# Altium project BACKPMAN3Rev1.0.PrjPcb (part 1 of 2)
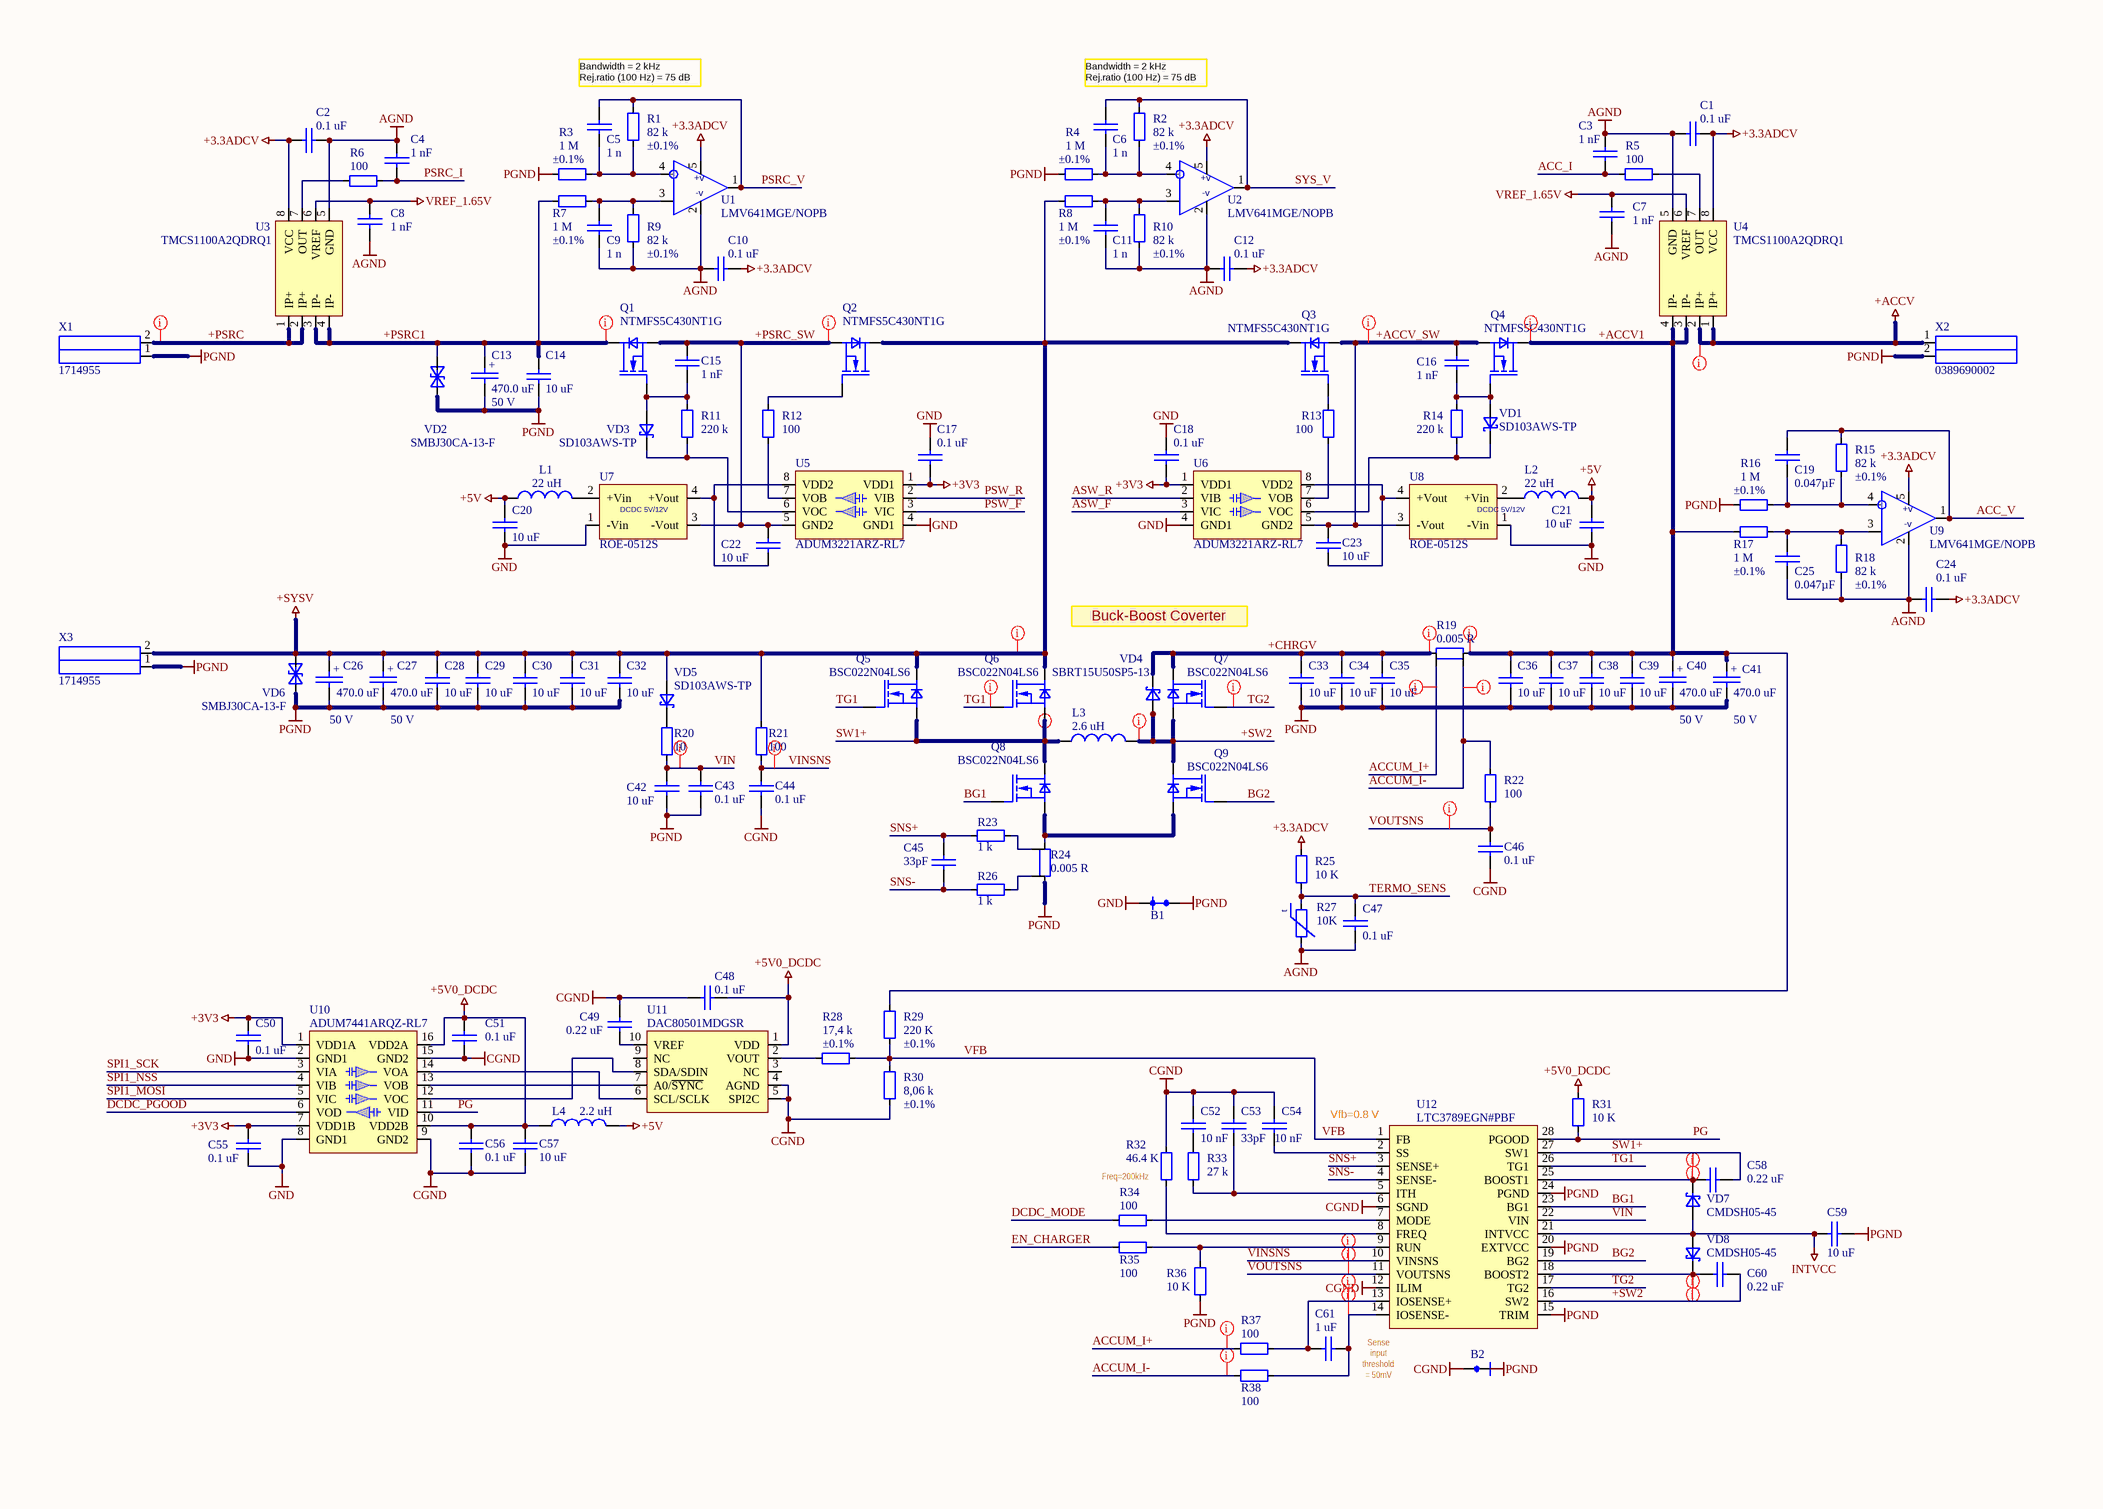
[diagram p0: BACKPMAN30_Charger.SchDoc]
4 sheets, 343 parts. Net scope: global (net labels, ports and power ports of the same name join across sheets).
Board file: BACKPMAN3Rev1.0.PcbDoc
Sheets:
  BACKPMAN30_Charger.SchDoc
  BACKPMAN30_CPU.SchDoc
  BACKPMAN30_Intfs.SchDoc
  BACKPMAN30_PwrSw.SchDoc

## Sheet BACKPMAN30_Charger.SchDoc
size A3

### Parts
B1  Net tie W10  [Net tee W 10 mm]  (value not drawn)  (net tie, no BOM)
B2  Net tie 0.3mm  [Net tee 0.3 mm]  (value not drawn)  (net tie, no BOM)
C1  value 0.1 uF  [1608[0603]]  (hidden comment: 0603B104K500CT)
C2  value 0.1 uF  [1608[0603]]  (hidden comment: 0603B104K500CT)
C3  value 1 nF  [0603 CAP]  (hidden comment: Capacitor)
C4  value 1 nF  [0603 CAP]  (hidden comment: Capacitor)
C5  value 1 n  [1608[0603]]  (hidden comment: 06033A102FAT2A)
C6  value 1 n  [1608[0603]]  (hidden comment: 06033A102FAT2A)
C7  value 1 nF  [0603 CAP]  (hidden comment: Capacitor)
C8  value 1 nF  [0603 CAP]  (hidden comment: Capacitor)
C9  value 1 n  [1608[0603]]  (hidden comment: 06033A102FAT2A)
C10  value 0.1 uF  [1608[0603]]  (hidden comment: 0603B104K500CT)
C11  value 1 n  [1608[0603]]  (hidden comment: 06033A102FAT2A)
C12  value 0.1 uF  [1608[0603]]  (hidden comment: 0603B104K500CT)
C13  value 470.0 uF  Voltage: 50 V  [Through Hole 12.5/20/5]  (hidden comment: EEU-FM1H471)
C14  value 10 uF  [3225[1210]]  (hidden comment: GMC32X7R106K50NT)
C15  value 1 nF  [0603 CAP]  (hidden comment: Capacitor)
C16  value 1 nF  [0603 CAP]  (hidden comment: Capacitor)
C17  value 0.1 uF  [1608[0603]]  (hidden comment: CL10B104KA8NNND)
C18  value 0.1 uF  [1608[0603]]  (hidden comment: CL10B104KA8NNND)
C19  value 0.047µF  [0603 CAP]  (hidden comment: Capacitor)
C20  value 10 uF  [3225[1210]]  (hidden comment: GMC32X7R106K50NT)
C21  value 10 uF  [3225[1210]]  (hidden comment: GMC32X7R106K50NT)
C22  value 10 uF  [3225[1210]]  (hidden comment: GMC32X7R106K50NT)
C23  value 10 uF  [3225[1210]]  (hidden comment: GMC32X7R106K50NT)
C24  value 0.1 uF  [1608[0603]]  (hidden comment: 0603B104K500CT)
C25  value 0.047µF  [0603 CAP]  (hidden comment: Capacitor)
C26  value 470.0 uF  Voltage: 50 V  [Through Hole 12.5/20/5]  (hidden comment: EEU-FM1H471)
C27  value 470.0 uF  Voltage: 50 V  [Through Hole 12.5/20/5]  (hidden comment: EEU-FM1H471)
C28  value 10 uF  [3225[1210]]  (hidden comment: GMC32X7R106K50NT)
C29  value 10 uF  [3225[1210]]  (hidden comment: GMC32X7R106K50NT)
C30  value 10 uF  [3225[1210]]  (hidden comment: GMC32X7R106K50NT)
C31  value 10 uF  [3225[1210]]  (hidden comment: GMC32X7R106K50NT)
C32  value 10 uF  [3225[1210]]  (hidden comment: GMC32X7R106K50NT)
C33  value 10 uF  [3225[1210]]  (hidden comment: GMC32X7R106K50NT)
C34  value 10 uF  [3225[1210]]  (hidden comment: GMC32X7R106K50NT)
C35  value 10 uF  [3225[1210]]  (hidden comment: GMC32X7R106K50NT)
C36  value 10 uF  [3225[1210]]  (hidden comment: GMC32X7R106K50NT)
C37  value 10 uF  [3225[1210]]  (hidden comment: GMC32X7R106K50NT)
C38  value 10 uF  [3225[1210]]  (hidden comment: GMC32X7R106K50NT)
C39  value 10 uF  [3225[1210]]  (hidden comment: GMC32X7R106K50NT)
C40  value 470.0 uF  Voltage: 50 V  [Through Hole 12.5/20/5]  (hidden comment: EEU-FM1H471)
C41  value 470.0 uF  Voltage: 50 V  [Through Hole 12.5/20/5]  (hidden comment: EEU-FM1H471)
C42  value 10 uF  [3225[1210]]  (hidden comment: GMC32X7R106K50NT)
C43  value 0.1 uF  [1608[0603]]  (hidden comment: 0603B104K500CT)
C44  value 0.1 uF  [1608[0603]]  (hidden comment: 0603B104K500CT)
C45  value 33pF  [0603 CAP]  (hidden comment: Capacitor)
C46  value 0.1 uF  [1608[0603]]  (hidden comment: 0603B104K500CT)
C47  value 0.1 uF  [1608[0603]]  (hidden comment: 0603B104K500CT)
C48  value 0.1 uF  [1608[0603]]  (hidden comment: 0603B104K500CT)
C49  value 0.22 uF  [1608[0603]]  (hidden comment: C1608X7R1H224K080AB)
C50  value 0.1 uF  [1608[0603]]  (hidden comment: CL10B104KA8NNND)
C51  value 0.1 uF  [1608[0603]]  (hidden comment: CL10B104KA8NNND)
C52  value 10 nF  [1608[0603]]  (hidden comment: GMC10X7R103M50NT)
C53  value 33pF  [0603 CAP]  (hidden comment: Capacitor)
C54  value 10 nF  [1608[0603]]  (hidden comment: GMC10X7R103M50NT)
C55  value 0.1 uF  [1608[0603]]  (hidden comment: CL10B104KA8NNND)
C56  value 0.1 uF  [1608[0603]]  (hidden comment: CL10B104KA8NNND)
C57  value 10 uF  [2012[0805]]  (hidden comment: GRM21BR61E106KA73L)
C58  value 0.22 uF  [1608[0603]]  (hidden comment: C1608X7R1H224K080AB)
C59  value 10 uF  [2012[0805]]  (hidden comment: GRM21BR61E106KA73L)
C60  value 0.22 uF  [1608[0603]]  (hidden comment: C1608X7R1H224K080AB)
C61  value 1 uF  [1608[0603]]  (hidden comment: C1608X5R1H105K080AB)
L1  value 22 uH  [2518]  (hidden comment: BRC2518T220K)
L2  value 22 uH  [2518]  (hidden comment: BRC2518T220K)
L3  value 2.6 uH  [7443556260   Wurth Elektronik]  (hidden comment: 7443556260)
L4  value 2.2 uH  [LSQPB3225]  (hidden comment: BRL3225T2R2M)
Q1  NTMFS5C430NT1G  [SO8FL Universal Footprint]
Q2  NTMFS5C430NT1G  [SO8FL Universal Footprint]
Q3  NTMFS5C430NT1G  [SO8FL Universal Footprint]
Q4  NTMFS5C430NT1G  [SO8FL Universal Footprint]
Q5  BSC022N04LS6  [SO8FL Universal Footprint]
Q6  BSC022N04LS6  [SO8FL Universal Footprint]
Q7  BSC022N04LS6  [SO8FL Universal Footprint]
Q8  BSC022N04LS6  [SO8FL Universal Footprint]
Q9  BSC022N04LS6  [SO8FL Universal Footprint]
R1  value 82 k  Tolerance: ±0.1%  [0603]  (hidden comment: Resistor)
R2  value 82 k  Tolerance: ±0.1%  [0603]  (hidden comment: Resistor)
R3  value 1 M  Tolerance: ±0.1%  [0805]  (hidden comment: RT0805BRE071ML)
R4  value 1 M  Tolerance: ±0.1%  [0805]  (hidden comment: RT0805BRE071ML)
R5  value 100  [0603]  (hidden comment: Resistor)
R6  value 100  [0603]  (hidden comment: Resistor)
R7  value 1 M  Tolerance: ±0.1%  [0805]  (hidden comment: RT0805BRE071ML)
R8  value 1 M  Tolerance: ±0.1%  [0805]  (hidden comment: RT0805BRE071ML)
R9  value 82 k  Tolerance: ±0.1%  [0603]  (hidden comment: Resistor)
R10  value 82 k  Tolerance: ±0.1%  [0603]  (hidden comment: Resistor)
R11  value 220 k  [0603]  (hidden comment: Resistor)
R12  value 100  [0603]  (hidden comment: Resistor)
R13  value 100  [0603]  (hidden comment: Resistor)
R14  value 220 k  [0603]  (hidden comment: Resistor)
R15  value 82 k  Tolerance: ±0.1%  [0603]  (hidden comment: Resistor)
R16  value 1 M  Tolerance: ±0.1%  [0805]  (hidden comment: RT0805BRE071ML)
R17  value 1 M  Tolerance: ±0.1%  [0805]  (hidden comment: RT0805BRE071ML)
R18  value 82 k  Tolerance: ±0.1%  [0603]  (hidden comment: Resistor)
R19  value 0.005 R  [FC4L110]  (hidden comment: FC4L110R005FER)
R20  value 10  [0805]  (hidden comment: Resistor)
R21  value 100  [0603]  (hidden comment: Resistor)
R22  value 100  [0603]  (hidden comment: Resistor)
R23  value 1 k  [0603]  (hidden comment: Resistor)
R24  value 0.005 R  [FC4L110]  (hidden comment: FC4L110R005FER)
R25  value 10 K  [0603]  (hidden comment: RMCF0603FT10K0)
R26  value 1 k  [0603]  (hidden comment: Resistor)
R27  value 10K  [0603]  (hidden comment: NTCG163JX103DTDS)
R28  value 17,4 k  Tolerance: ±0.1%  [0603]  (hidden comment: Resistor)
R29  value 220 K  Tolerance: ±0.1%  [0603]  (hidden comment: TNPW0603220KBEEA)
R30  value 8,06 k  Tolerance: ±0.1%  [0603]  (hidden comment: Resistor)
R31  value 10 K  [0603]  (hidden comment: RMCF0603FT10K0)
R32  value 46.4 K  [0603]  (hidden comment: RC0603FR-0746K4L)
R33  value 27 k  [0603]  (hidden comment: Resistor)
R34  value 100  [0603]  (hidden comment: Resistor)
R35  value 100  [0603]  (hidden comment: Resistor)
R36  value 10 K  [0603]  (hidden comment: RMCF0603FT10K0)
R37  value 100  [0603]  (hidden comment: Resistor)
R38  value 100  [0603]  (hidden comment: Resistor)
U1  LMV641MGE/NOPB  [SOT-353 ON Semi]
U2  LMV641MGE/NOPB  [SOT-353 ON Semi]
U3  TMCS1100A2QDRQ1  [8-SOIC Linear]
U4  TMCS1100A2QDRQ1  [8-SOIC Linear]
U5  ADUM3221ARZ-RL7  [8-SOIC Linear]
U6  ADUM3221ARZ-RL7  [8-SOIC Linear]
U7  ROE-0512S  [Recom 4-SIP module]
U8  ROE-0512S  [Recom 4-SIP module]
U9  LMV641MGE/NOPB  [SOT-353 ON Semi]
U10  ADUM7441ARQZ-RL7  [QSOP-16 AD]
U11  DAC80501MDGSR  [10-Lead Plastic MSOP Linear]
U12  LTC3789EGN#PBF  [28-Lead Plastic SSOP Linear]
VD1  SD103AWS-TP  [SOD323]
VD2  SMBJ30CA-13-F  [DO-214AA_SMBJ BI]
VD3  SD103AWS-TP  [SOD323]
VD4  SBRT15U50SP5-13  [PowerDI 5]
VD5  SD103AWS-TP  [SOD323]
VD6  SMBJ30CA-13-F  [DO-214AA_SMBJ BI]
VD7  PartName: CMDSH05-45  [SOD323]  (hidden comment: CMDSH05-45 TR PBFREE)
VD8  PartName: CMDSH05-45  [SOD323]  (hidden comment: CMDSH05-45 TR PBFREE)
X1  1714955  [MKDS5/2-6.35]
X2  0389690002  [Molex 389690002]
X3  1714955  [MKDS5/2-6.35]

### Nets
+3.3ADCV: C1.2 C2.2 C10.1 C12.1 C24.1 R25.2 U1.5(V+) U2.5(V+) U3.8(VCC) U4.8(VCC) U9.5(V+)
+3V3: C17.1 C18.1 C50.2 C55.2 U5.1(VDD1) U6.1(VDD1) U10.1(VDD1A) U10.7(VDD1B)
+5V: C20.1 C21.1 L1.1 L2.1 L4.2
+5V0_DCDC: C48.1 C51.2 C56.2 C57.2 L4.1 R31.1 U10.10(VDD2B) U10.16(VDD2A) U11.1(VDD)
+ACCV: U4.1(IP+) U4.2(IP+) X2.1
+SYSV: C26.1 C27.1 C28.1 C29.1 C30.1 C31.1 C32.1 Q2.3(D) Q3.3(D) Q5.3(D) Q6.3(D) R8.1 R21.2 VD5.1(A) VD6.2(A) X3.2
AGND: C1.1 C2.1 C3.2 C4.2 C7.1 C8.1 C9.2 C10.2 C11.2 C12.2 C24.2 C25.2 C47.2 R9.1 R10.1 R18.1 R27.1 U1.2(GND) U2.2(GND) U3.5(GND) U4.5(GND) U9.2(GND)
CGND: B2.2 C44.2 C46.2 C48.2 C49.1 C51.1 C52.1 C53.1 C54.1 C56.1 C57.1 R30.1 R32.1 U10.9(GND2) U10.15(GND2) U11.4(AGND) U11.5(SPI2C) U12.6(SGND) U12.12(ILIM)
GND: B1.1 C17.2 C18.2 C20.2 C21.2 C50.1 C55.1 U5.4(GND1) U6.4(GND1) U7.1(-Vin) U8.1(-Vin) U10.2(GND1) U10.8(GND1)
INTVCC: C59.1 U12.21(INTVCC) VD7.1(A) VD8.1(A)
PGND: B1.2 B2.1 C13.2 C14.2 C26.2 C27.2 C28.2 C29.2 C30.2 C31.2 C32.2 C33.2 C34.2 C35.2 C36.2 C37.2 C38.2 C39.2 C40.2 C41.2 C42.2 C43.2 C59.2 R3.1 R4.1 R16.1 R24.2 R36.1 U12.15(TRIM) U12.20(EXTVCC) U12.24(PGND) VD2.1(C) VD6.1(C) X1.1 X2.2 X3.1
VREF_1.65V: C7.2 C8.2 U3.6(VREF) U4.6(VREF)
+ACCV1: C36.1 C37.1 C38.1 C39.1 C40.1 C41.1 Q4.3(D) R17.1 R19.2 R29.2 U4.3(IP-) U4.4(IP-)
+ACCV_SW: C16.2 C23.1 Q3.2(S) Q4.2(S) U6.5(GND2) U8.3(-Vout)
+CHRGV: C33.1 C34.1 C35.1 Q7.3(D) R19.1 VD4.3
+PSRC: U3.1(IP+) U3.2(IP+) X1.2
+PSRC1: C13.1 C14.1 Q1.3(D) R7.1 U3.3(IP-) U3.4(IP-) VD2.2(A)
+PSRC_SW: C15.2 C22.1 Q1.2(S) Q2.2(S) U5.5(GND2) U7.3(-Vout)
+SW2: C60.2 L3.2 Q7.2(S) Q9.3(D) U12.16(SW2) VD4.1 VD4.2
ACC_I: C3.1 R5.1
ACC_V: C19.1 R15.2 U9.1(OUT)
ACCUM_I+: R19.3 R37.2
ACCUM_I-: R19.4 R22.2 R38.2
ASW_F: U6.3(VIC)
ASW_R: U6.2(VIB)
BG1: Q8.1(G) U12.23(BG1)
BG2: Q9.1(G) U12.19(BG2)
DCDC_MODE: R34.2
DCDC_PGOOD: U10.6(VOD)
EN_CHARGER: R35.2
PG: R31.2 U10.11(VID) U12.28(PGOOD)
PSRC_I: C4.1 R6.1
PSRC_V: C5.1 R1.2 U1.1(OUT)
PSW_F: U5.3(VIC)
PSW_R: U5.2(VIB)
SNS+: C45.1 R23.2 U12.3(SENSE+)
SNS-: C45.2 R26.2 U12.4(SENSE-)
SPI1_MOSI: U10.5(VIC)
SPI1_NSS: U10.4(VIB)
SPI1_SCK: U10.3(VIA)
SW1+: C58.2 L3.1 Q5.2(S) Q6.2(S) Q8.3(D) U12.27(SW1)
SYS_V: C6.1 R2.2 U2.1(OUT)
TERMO_SENS: C47.1 R25.1 R27.2
TG1: Q5.1(G) Q6.1(G) U12.26(TG1)
TG2: Q7.1(G) U12.17(TG2)
VFB: R28.2 R29.1 R30.2 U12.1(FB)
VIN: C42.1 C43.1 R20.1 U12.22(VIN)
VINSNS: C44.1 R21.1 U12.10(VINSNS)
VOUTSNS: C46.1 R22.1 U12.11(VOUTSNS)
NetC5_2: C5.2 R1.1 R3.2 U1.4(IN-)
NetC6_2: C6.2 R2.1 R4.2 U2.4(IN-)
NetC9_1: C9.1 R7.2 R9.2 U1.3(IN+)
NetC11_1: C11.1 R8.2 R10.2 U2.3(IN+)
NetC15_1: C15.1 Q1.1(G) R11.2 VD3.1(A)
NetC16_1: C16.1 Q4.1(G) R14.2 VD1.1(A)
NetC19_2: C19.2 R15.1 R16.2 U9.4(IN-)
NetC22_2: C22.2 U5.8(VDD2) U7.4(+Vout)
NetC23_2: C23.2 U6.8(VDD2) U8.4(+Vout)
NetC25_1: C25.1 R17.2 R18.2 U9.3(IN+)
NetC49_2: C49.2 U11.10(VREF)
NetC52_2: C52.2 R33.2
NetC53_2: C53.2 R33.1 U12.5(ITH)
NetC54_2: C54.2 U12.2(SS)
NetC58_1: C58.1 U12.25(BOOST1) VD7.2(C)
NetC60_1: C60.1 U12.18(BOOST2) VD8.2(C)
NetC61_1: C61.1 R38.1 U12.14(IOSENSE-)
NetC61_2: C61.2 R37.1 U12.13(IOSENSE+)
NetL1_2: L1.2 U7.2(+Vin)
NetL2_2: L2.2 U8.2(+Vin)
NetQ2_1: Q2.1(G) R12.2
NetQ3_1: Q3.1(G) R13.2
NetQ8_2: Q8.2(S) Q9.2(S) R24.1
NetR5_2: R5.2 U4.7(OUT)
NetR6_2: R6.2 U3.7(OUT)
NetR11_1: R11.1 U5.6(VOC) VD3.2(C)
NetR12_1: R12.1 U5.7(VOB)
NetR13_1: R13.1 U6.7(VOB)
NetR14_1: R14.1 U6.6(VOC) VD1.2(C)
NetR20_2: R20.2 VD5.2(C)
NetR23_1: R23.1 R24.3
NetR24_4: R24.4 R26.1
NetR28_1: R28.1 U11.2(VOUT)
NetR32_2: R32.2 U12.8(FREQ)
NetR34_1: R34.1 U12.7(MODE)
NetR35_1: R35.1 R36.2 U12.9(RUN)
NetU10_12: U10.12(VOC) U11.8(SDA/SDIN)
NetU10_13: U10.13(VOB) U11.7(A0/~{SYNC})
NetU10_14: U10.14(VOA) U11.6(SCL/SCLK)

Not connected (* = marked no-connect by the designer): U11 3(NC) 9(NC)

### Layout directives
net class 24V: +ACCV, +ACCV1, +ACCV_SW, +CHRGV, +PSRC, +PSRC1, +PSRC_SW, +SW2, +SYSV, ACCUM_I+, ACCUM_I-, NetC58_1, NetC60_1, NetC61_1, NetC61_2, SW1+, TG1, TG2, VIN, VINSNS, VOUTSNS

### Notes on the sheet
- Bandwidth = 2 kHz
  Rej.ratio (100 Hz) = 75 dB
- Buck-Boost Coverter
- (near U12) Vfb=0.8 V
- (near R32) Freq=200kHz
- Sense input threshold = 50mV
- (in symbol EEU-FM1H471) +
- (in symbol LMV641MGE/NOPB) +v; -v
- (in symbol NTCG163JX103DTDS) t
- (in symbol ROE-0512S) DCDC 5V/12V

### Library data of the parts
B1 = Net tie W10: Net tie width 10 mm
C1 C2 C10 C12 C17 C18 C24 C43 C44 C46-C48 C50 C51 C55 C56 = 0603B104K500CT: 0.1 µF ±10% 50V Ceramic Capacitor X7R 0603 (1608 Metric), -55°C ~ 125°C; Manufacturer: Walsin Technology Corporation; PartNum: 1292-1643-1-ND; Tolerance: +-10%; Distributor: Digi-Key; PartName: 0603B104K500CT; Price: 0.0062 Euro; Voltage: 50V
C3 C4 C7 C8 C15 C16 = CC0603JRX7R9BB102: 1000pF, ±5%, 50V, X7R, 0603 (1608 Metric), -55°C ~ 125°C, -, General Purpose; Manufacturer: Yageo; PartNum: 311-3361-1-ND; Voltage - Rated: 50V; Part Number: CC0603JRX7R9BB102; Distributor: Digi-Key; PartName: CC0603JRX7R9BB102; Price: 0.01920; Tolerance: ±5%; Temperature Coefficient: X7R; Operating Temperature: -55°C ~ 125°C; Features: -; Package / Case: 0603 (1608 Metric)
C5 C6 C9 C11 = 06033A102FAT2A: 1000 pF ±1% 25V Ceramic Capacitor C0G, NP0 0603 (1608 Metric), -55°C ~ 125°C; Manufacturer: AVX Corporation; PartNum: 478-7896-1-ND; Tolerance: ±1%; Price: 0.2$; Distributor: DigiKey; Voltage: 25 V; PartName: 06033A102FAT2A
C13 C26 C27 C40 C41 = EEU-FM1H471: 470.0uF, 50V, Aluminium Electrolytic Capacitors, Diam. 12.5mm, Lead sp. 5 mm, Length 22mm, 2.26 mA, 22 mOhms, 5000 Hour, -40°C...105°C; Manufacturer: Panasonic Electronic Components; PartNum: P12400-ND; Tolerance: +-20%; Distributor: Digi-Key; Price: 0.52$; PartName: EEU-FM1H471
C14 C20-C23 C28-C39 C42 = GMC32X7R106K50NT: 10 µF ±10%, 50V, Ceramic Capacitor X7R, 1210 (3225 Metric), -55°C ~ 125°C; Manufacturer: CAL-CHIP ELECTRONICS, INC.; PartNum: 2571-GMC32X7R106K50NTTR-ND; Distributor: Digi-Key; PartName: GMC32X7R106K50NT; Tolerance: ±10%; Voltage: 50V
C19 C25 = CC0603JRX7R9BB473: 0.047µF, ±5%, 50V, X7R, 0603 (1608 Metric), -55°C ~ 125°C, -, General Purpose; Manufacturer: Yageo; PartNum: 311-4019-1-ND; Part Number: CC0603JRX7R9BB473; Distributor: Digi-Key; PartName: CC0603JRX7R9BB473; Price: 0.03660; Tolerance: ±5%; Voltage - Rated: 50V; Temperature Coefficient: X7R; Operating Temperature: -55°C ~ 125°C; Features: -; Package / Case: 0603 (1608 Metric)
C45 C53 = 885012006054: 33pF, ±5%, 50V, C0G, NP0, 0603 (1608 Metric), -55°C ~ 125°C, -, General Purpose; Manufacturer: Wurth Electronics Inc.; PartNum: 732-7796-1-ND; Voltage - Rated: 50V; Part Number: 885012006054; Distributor: Digi-Key; PartName: 885012006054; Price: 0.02150; Tolerance: ±5%; Temperature Coefficient: C0G, NP0; Operating Temperature: -55°C ~ 125°C; Features: -; Package / Case: 0603 (1608 Metric)
C49 C58 C60 = C1608X7R1H224K080AB: 0.22 uF, ±10% 50V Ceramic Capacitor X7R, Low ESL 0603 (1608 Metric), -55°C ~ 125°C; Manufacturer: TDK Corporation; PartNum: 445-7408-1-ND; Tolerance: +-10%; Distributor: Digi-Key; PartName: C1608X7R1H224K080AB; Price: 0.0062 Euro; Voltage: 50 V
C52 C54 = GMC10X7R103M50NT: 10 nF, ±20%, 50V,  Ceramic Capacitor X7R 0603 (1608 Metric), -55°C ~ 125°C; Manufacturer: CAL-CHIP ELECTRONICS, INC.; PartNum: 2571-GMC10X7R103M50NTTR-ND; Tolerance: +-10%; Distributor: Digi-Key; PartName: GMC10X7R103M50NT; Price: 0.0047 Euro; Voltage: 50 V
C57 C59 = GRM21BR61E106KA73L: 10 µF ±10%, 25V, Ceramic Capacitor X5R 0805 (2012 Metric),  -55°C ~ 85°C; Manufacturer: Murata Electronics; PartNum: 490-5523-1-ND; Distributor: Digi-Key; PartName: GRM21BR61E106KA73L; Price: 0.11$; Tolerance: ±10%; Voltage: 25V
C61 = C1608X5R1H105K080AB: 1 uF, ±10%, Low ESL, 50V, Ceramic Capacitor X5R 0603 (1608 Metric), -55°C ~ 85°C; Manufacturer: Venkel; PartNum: 445-7468-1-ND; Distributor: Digi-Key; PartName: C1608X5R1H105K080AB; Tolerance: ±10%; Voltage: 50V
L1 L2 = BRC2518T220K: 22 µH Unshielded Wirewound Inductor, 490 mA, 560mOhm, 1007 (2518 Metric); Manufacturer: Taiyo Yuden; PartNum: 587-2439-1-ND; Tolerance: ±10%; Distributor: Digi-Key; PartName: BRC2518T220K; Supplier 1: Digi-Key; Supplier Part Number 1: 587-2439-1-ND
L3 = 7443556260: 2.6 uH, 31.5 A, ±20%, 1.58 mOhm, -40°C ~ 125°C; Manufacturer: Würth Elektronik; PartNum: 732-2170-1-ND; Distributor: Digi-Key; Price: 5.35$; Tolerance: ±20%; PartName: 7443556260
L4 = BRL3225T2R2M: Inductors 2.2 uH, 1.6 A, 0.078 Ohms, ±20% -40°C ~ 105°C, 1210 (3225 Metric); Manufacturer: Taiyo Yuden; PartNum: 587-2165-1-ND; Distributor: Digi-Key; Price: 0.16$; Tolerance: ±20%; PartName: BRL3225T2R2M
Q1-Q4 = NTMFS5C430NT1G: MOSFET N-CH, 35A (Ta), 185A (Tc), 40V, Vgs=±20V, 1.7 mOhm, 47nC @ 10V, 5-DFN (5x6), -55°C ~ 175°C; Manufacturer: Texas Instruments; PartNum: NTMFS5C430NT1GOSCT-ND; Price: 2.68$; Distributor: Digi-Key; PartName: NTMFS5C430NT1G
Q5-Q9 = BSC022N04LS6ATMA1: MOSFET N-CH, 100 A, 60V, Vgs=±20V, 1.8 mOhm, 41nC @ 10V, 5-DFN (5x6), -55°C ~ 150°C; Manufacturer: Infineon Technologies; PartNum: BSC022N04LS6ATMA1CT-ND; Price: 1.33; Distributor: Digi-Key; PartName: BSC022N04LS6ATMA1; Supplier 1: Digi-Key; Supplier Part Number 1: BSC022N04LS6ATMA1CT-ND
R1 R2 R9 R10 R15 R18 = ERA-3AEB823V: 82 kOhms, ±0.1%, 0.1W, 1/10W, Thin Film, ±25ppm/°C, 0603 (1608 Metric), -55°C ~ 155°C, Automotive AEC-Q200; Manufacturer: Panasonic Electronic Components; PartNum: P82KDBCT-ND; Voltage: 75V; Distributor: Digi-Key; Price: 0.26; PartName: ERA-3AEB823V; Part Number: ERA-3AEB823V; Temperature Coefficient: ±25ppm/°C; Operating Temperature: -55°C ~ 155°C; Power (Watts): 0.1W, 1/10W; Features: Automotive AEC-Q200; Package / Case: 0603 (1608 Metric)
R3 R4 R7 R8 R16 R17 = RT0805BRE071ML: 1M, ±0.1%, ±50ppm/°C, 0.125W, 1/8W Chip Resistor 0805 (2012 Metric) - Thin Film,-55°C ~ 155°C; Manufacturer: YAGEO; PartNum: YAG4967CT-ND; Distributor: Digi-Key; Price: 0.09$; PartName: RT0805BRE071ML
R5 R6 R12 R13 R21 R22 R34 R35 R37 R38 = RMCF0603FT100R: 100 Ohms, ±1%, 0.1W, 1/10W, Thick Film, ±100ppm/°C, 0603 (1608 Metric), -55°C ~ 155°C, Automotive AEC-Q200; Manufacturer: Stackpole Electronics Inc.; PartNum: RMCF0603FT100RCT-ND; Voltage: 75V; Distributor: Digi-Key; Price: 0.00690; Tolerance: ±1%; PartName: RMCF0603FT100R; Part Number: RMCF0603FT100R; Temperature Coefficient: ±100ppm/°C; Operating Temperature: -55°C ~ 155°C; Power (Watts): 0.1W, 1/10W; Features: Automotive AEC-Q200; Package / Case: 0603 (1608 Metric)
R11 R14 = RMCF0603FT220K: 220 kOhms, ±1%, 0.1W, 1/10W, Thick Film, ±100ppm/°C, 0603 (1608 Metric), -55°C ~ 155°C, Automotive AEC-Q200; Manufacturer: Stackpole Electronics Inc.; PartNum: RMCF0603FT220KCT-ND; Voltage: 75V; Distributor: Digi-Key; Price: 0.00690; Tolerance: ±1%; PartName: RMCF0603FT220K; Part Number: RMCF0603FT220K; Temperature Coefficient: ±100ppm/°C; Operating Temperature: -55°C ~ 155°C; Power (Watts): 0.1W, 1/10W; Features: Automotive AEC-Q200; Package / Case: 0603 (1608 Metric)
R19 R24 = FC4L110R005FER: Curr.sens.res. 0.005 OHM 5W 1% , 4320 (50110 Metric); Manufacturer: Ohmite; PartNum: 588-FC4L110R005FER; Distributor: Digi-Key; Price: 2.42; Tolerance: 1%; PartName: FC4L110R005FER
R20 = RMCF0805FT10R0: 10 Ohms, ±1%, 0.125W, 1/8W, Thick Film, ±100ppm/°C, 0805 (2012 Metric), -55°C ~ 155°C, Automotive AEC-Q200; Manufacturer: Stackpole Electronics Inc.; PartNum: RMCF0805FT10R0CT-ND; Voltage: 150V; Distributor: Digi-Key; Price: 0.00950; Tolerance: ±1%; PartName: RMCF0805FT10R0; Part Number: RMCF0805FT10R0; Temperature Coefficient: ±100ppm/°C; Operating Temperature: -55°C ~ 155°C; Power (Watts): 0.125W, 1/8W; Features: Automotive AEC-Q200; Package / Case: 0805 (2012 Metric)
R23 R26 = RMCF0603FG1K00: 1 kOhms, ±1%, 0.1W, 1/10W, Thick Film, ±100ppm/°C, 0603 (1608 Metric), -55°C ~ 155°C, Automotive AEC-Q200; Manufacturer: Stackpole Electronics Inc.; PartNum: RMCF0603FG1K00CT-ND; Voltage: 75V; Distributor: Digi-Key; Price: 0.00690; Tolerance: ±1%; PartName: RMCF0603FG1K00; Part Number: RMCF0603FG1K00; Temperature Coefficient: ±100ppm/°C; Operating Temperature: -55°C ~ 155°C; Power (Watts): 0.1W, 1/10W; Features: Automotive AEC-Q200; Package / Case: 0603 (1608 Metric)
R25 R31 R36 = RMCF0603FT10K0: 10 kOhms ±1%, ±100ppm/°C,  0.1W, 1/10W Chip Resistor 0603 (1608 Metric) Automotive AEC-Q200 Thick Film, -55°C ~ 155°C; Manufacturer: Stackpole Electronics Inc; PartNum: RMCF0603FT10K0CT-ND; Distributor: Digi-Key; Price: 0.0017$; Tolerance: 1%; PartName: RMCF0603FT10K0
R27 = NTCG163JX103DTDS: NTC Thermistor 10k, B25/50 3380K, ±0.5%,  0603 (1608 Metric), -40°C ~ 125°C; Manufacturer: TDK Corporation; PartNum: 445-174519-1-ND; Distributor: Digi-Key; Price: 0.22; PartName: NTCG163JX103DTDS
R28 = ERA-3AEB1742V: 17,4 kOhms, ±0.1%, 0.1W, 1/10W, Thin Film, ±25ppm/°C, 0603 (1608 Metric), -55°C ~ 155°C, Automotive AEC-Q200; Manufacturer: Panasonic Electronic Components; PartNum: P17.4KDBCT-ND; Voltage: 75V; Distributor: Digi-Key; Price: 0.26; PartName: ERA-3AEB1742V; Part Number: ERA-3AEB1742V; Temperature Coefficient: ±25ppm/°C; Operating Temperature: -55°C ~ 155°C; Power (Watts): 0.1W, 1/10W; Features: Automotive AEC-Q200; Package / Case: 0603 (1608 Metric)
R29 = TNPW0603220KBEEA: 220 kOhms ±0.1% 0.125W, 1/8W Chip Resistor 0603 (1608 Metric), Thin Film; Manufacturer: Vishay Dale; PartNum: 541-3175-1-ND; Distributor: Digi-Key; Price: 0.11$; PartName: TNPW0603220KBEEA
R30 = ERA-3AEB8061V: 8,06 kOhms, ±0.1%, 0.1W, 1/10W, Thin Film, ±25ppm/°C, 0603 (1608 Metric), -55°C ~ 155°C, Automotive AEC-Q200; Manufacturer: Panasonic Electronic Components; PartNum: P8.06KDBCT-ND; Voltage: 75V; Distributor: Digi-Key; Price: 0.26; PartName: ERA-3AEB8061V; Part Number: ERA-3AEB8061V; Temperature Coefficient: ±25ppm/°C; Operating Temperature: -55°C ~ 155°C; Power (Watts): 0.1W, 1/10W; Features: Automotive AEC-Q200; Package / Case: 0603 (1608 Metric)
R32 = RC0603FR-0746K4L: 46.4 kOhms ±1% 0.1W, 1/10W Chip Resistor 0603 (1608 Metric) Moisture Resistant Thick Film; Manufacturer: YAGEO; PartNum: 311-46.4KHRCT-ND; Voltage: 75 V; Distributor: Digi-Key; Price: 0.008 Euro; Tolerance: 1%; PartName: RC0603FR-0746K4L
R33 = RMCF0603FT27K0: 27 kOhms, ±1%, 0.1W, 1/10W, Thick Film, ±100ppm/°C, 0603 (1608 Metric), -55°C ~ 155°C, Automotive AEC-Q200; Manufacturer: Stackpole Electronics Inc.; PartNum: RMCF0603FT27K0CT-ND; Voltage: 75V; Distributor: Digi-Key; Price: 0.00690; Tolerance: ±1%; PartName: RMCF0603FT27K0; Part Number: RMCF0603FT27K0; Temperature Coefficient: ±100ppm/°C; Operating Temperature: -55°C ~ 155°C; Power (Watts): 0.1W, 1/10W; Features: Automotive AEC-Q200; Package / Case: 0603 (1608 Metric)
U1 U2 U9 = LMV641MGE/NOPB: OpAmp,  Rail-to-Rail,  10MHz, VSS 2.7V ~ 12V, Vofs 30µV,  SC-70-5, -40°C ~ 125°C; Manufacturer: Texas Instruments; PartNum: LMV641MGE/NOPBCT-ND; Price: 1.8$; Distributor: Digi-Key; PartName: LMV641MGE/NOPB; Supplier 1: Digi-Key; Supplier Part Number 1: 296-OPA991IDBVRCT-ND
U3 U4 = TMCS1100A2QDRQ1: Current Sensor ±14.5A, VCC=3V,  Hall Effect Bidirectional 8-SOIC (0.154", 3.90mm Width), -40°C ~ 125°C (TA); Manufacturer: Texas Instruments; PartNum: 595-TMCS1100A2QDRQ1; Price: 2.5$; Distributor: Mouser; PartName: TMCS1100A2QDRQ1
U5 U6 = ADUM3221ARZ-RL7: 4A Gate Driver Magnetic Coupling 2500Vrms 2 Channel 8-SOIC, -40°C ~ 125°C; Manufacturer: Analog Devices Inc.; PartNum: ADUM3221ARZ-RL7CT-ND; Distributor: Digi-Key; Price: 3.1$; PartName: ADUM3221ARZ-RL7
U7 U8 = ROE-0512S: Isolated Module DC DC Converter 1 Output 12V - - 84mA 4.5V - 5.5V Input; Manufacturer: Recom Power; PartNum: ROE-0512S-ND; Price: 2.8$; Distributor: Digi-Key; PartName: ROE-0512S; Supplier 1: Digi-Key; Supplier Part Number 1: ROE-0512S-ND
U10 = ADUM7441ARQZ-RL7: General Purpose Digital Isolator 1000Vrms 4 Channel 1Mbps 15kV/µs CMTI 16-SSOP (0.154", 3.90mm Width), -40°C ~ 105°C; Manufacturer: Analog Devices Inc.; PartNum: ADUM7441ARQZ-RL7CT-ND; Distributor: Digi-Key; Price: 2.4$; PartName: ADUM7441ARQZ-RL7
U11 = DAC80501MDGSR: 16 Bit Digital to Analog Converter, I²C, SPI, 10-VSSOP,  -40°C ~ 125°C; Manufacturer: Texas Instruments; PartNum: 296-DAC80501MDGSRCT-ND; Distributor: Digi-Key; PartName: DAC80501MDGSR; Price: 6$; Supplier 1: Digi-Key; Supplier Part Number 1: 296-DAC80501MDGSTCT-ND
U12 = LTC3789EGN#PBF: Buck-Boost Regulator Positive Output Step-Up/Step-Down DC-DC Controller IC, Vin 4...38V,  28-SSOP, -40°C ~ 125°C; Manufacturer: Linear Technology/Analog Devices; PartNum: LTC3789EGN#PBF-ND; Distributor: Digi-Key; PartName: LTC3789EGN#PBF; price: 5.6$; Supplier 1: Digi-Key; Supplier Part Number 1: LTC3789EGN#PBF-ND
VD1 VD3 VD5 = SD103AWS-TP: Diode Schottky 40 V 350mA Surface Mount SOD-323, -65°C ~ 125°C; Manufacturer: Micro Commercial Co; PartNum: SD103AWSTPMSCT-ND; PartName: SD103AWS-TP; Distributor: Digi-Key; Price: 0.1$
VD2 VD6 = SMBJ30CA-13-F: TVS 600W, Vbr=33.3V, Vcl=48.4V,  Bidirectional, SMB, -55°C ~ 150°C; Manufacturer: Diodes Incorporated; PartNum: SMBJ30CA-FDICT-ND; Voltage: 30V; Distributor: Digi-Key; Price: 0.21$; PartName: SMBJ30CA-13-F; Supplier 1: Digi-Key; Supplier Part Number 1: SMBJ30CA-FDICT-ND
VD4 = SBRT15U50SP5-13: Schottky Power Rectifier 15A, 50V, 470mV @ 15A, SMA, -65°C ~ 150°C; Manufacturer: Diodes Incorporated; PartNum: SBRT15U50SP5-13DICT-ND; Price: 0.83$; Distributor: Digi-Key; PartName: SBRT15U50SP5-13
VD7 VD8 = CMDSH05-45 TR PBFREE: Diode Schottky 45 V 500mA Surface Mount SOD-323, -65°C ~ 125°C; Manufacturer: Central Semiconductor Corp; PartNum: 1514-CMDSH05-45TRPBFREECT-ND; Distributor: Digi-Key; Price: 0.23$
X1 X3 = 1714955: TERMINAL BLOCK, 2WAY, 6.35 mm, 32A, 500V; Manufacturer: Phoenix Contact; PartNum: 277-1269-ND; Distributor: Digi-Key; Price: 1.49 Euro; PartName: 1714955
X2 = 0389690002: 2 Circuit 0.500" (12.70mm) Barrier Block Connector Screws with Captive Plate, 50A, 600V, 8-20AWG; Manufacturer: Molex; PartNum: WM7469-ND; Distributor: Digi-Key; Price: 1.03$; PartName: 0389690002

## Sheet BACKPMAN30_CPU.SchDoc
size A3
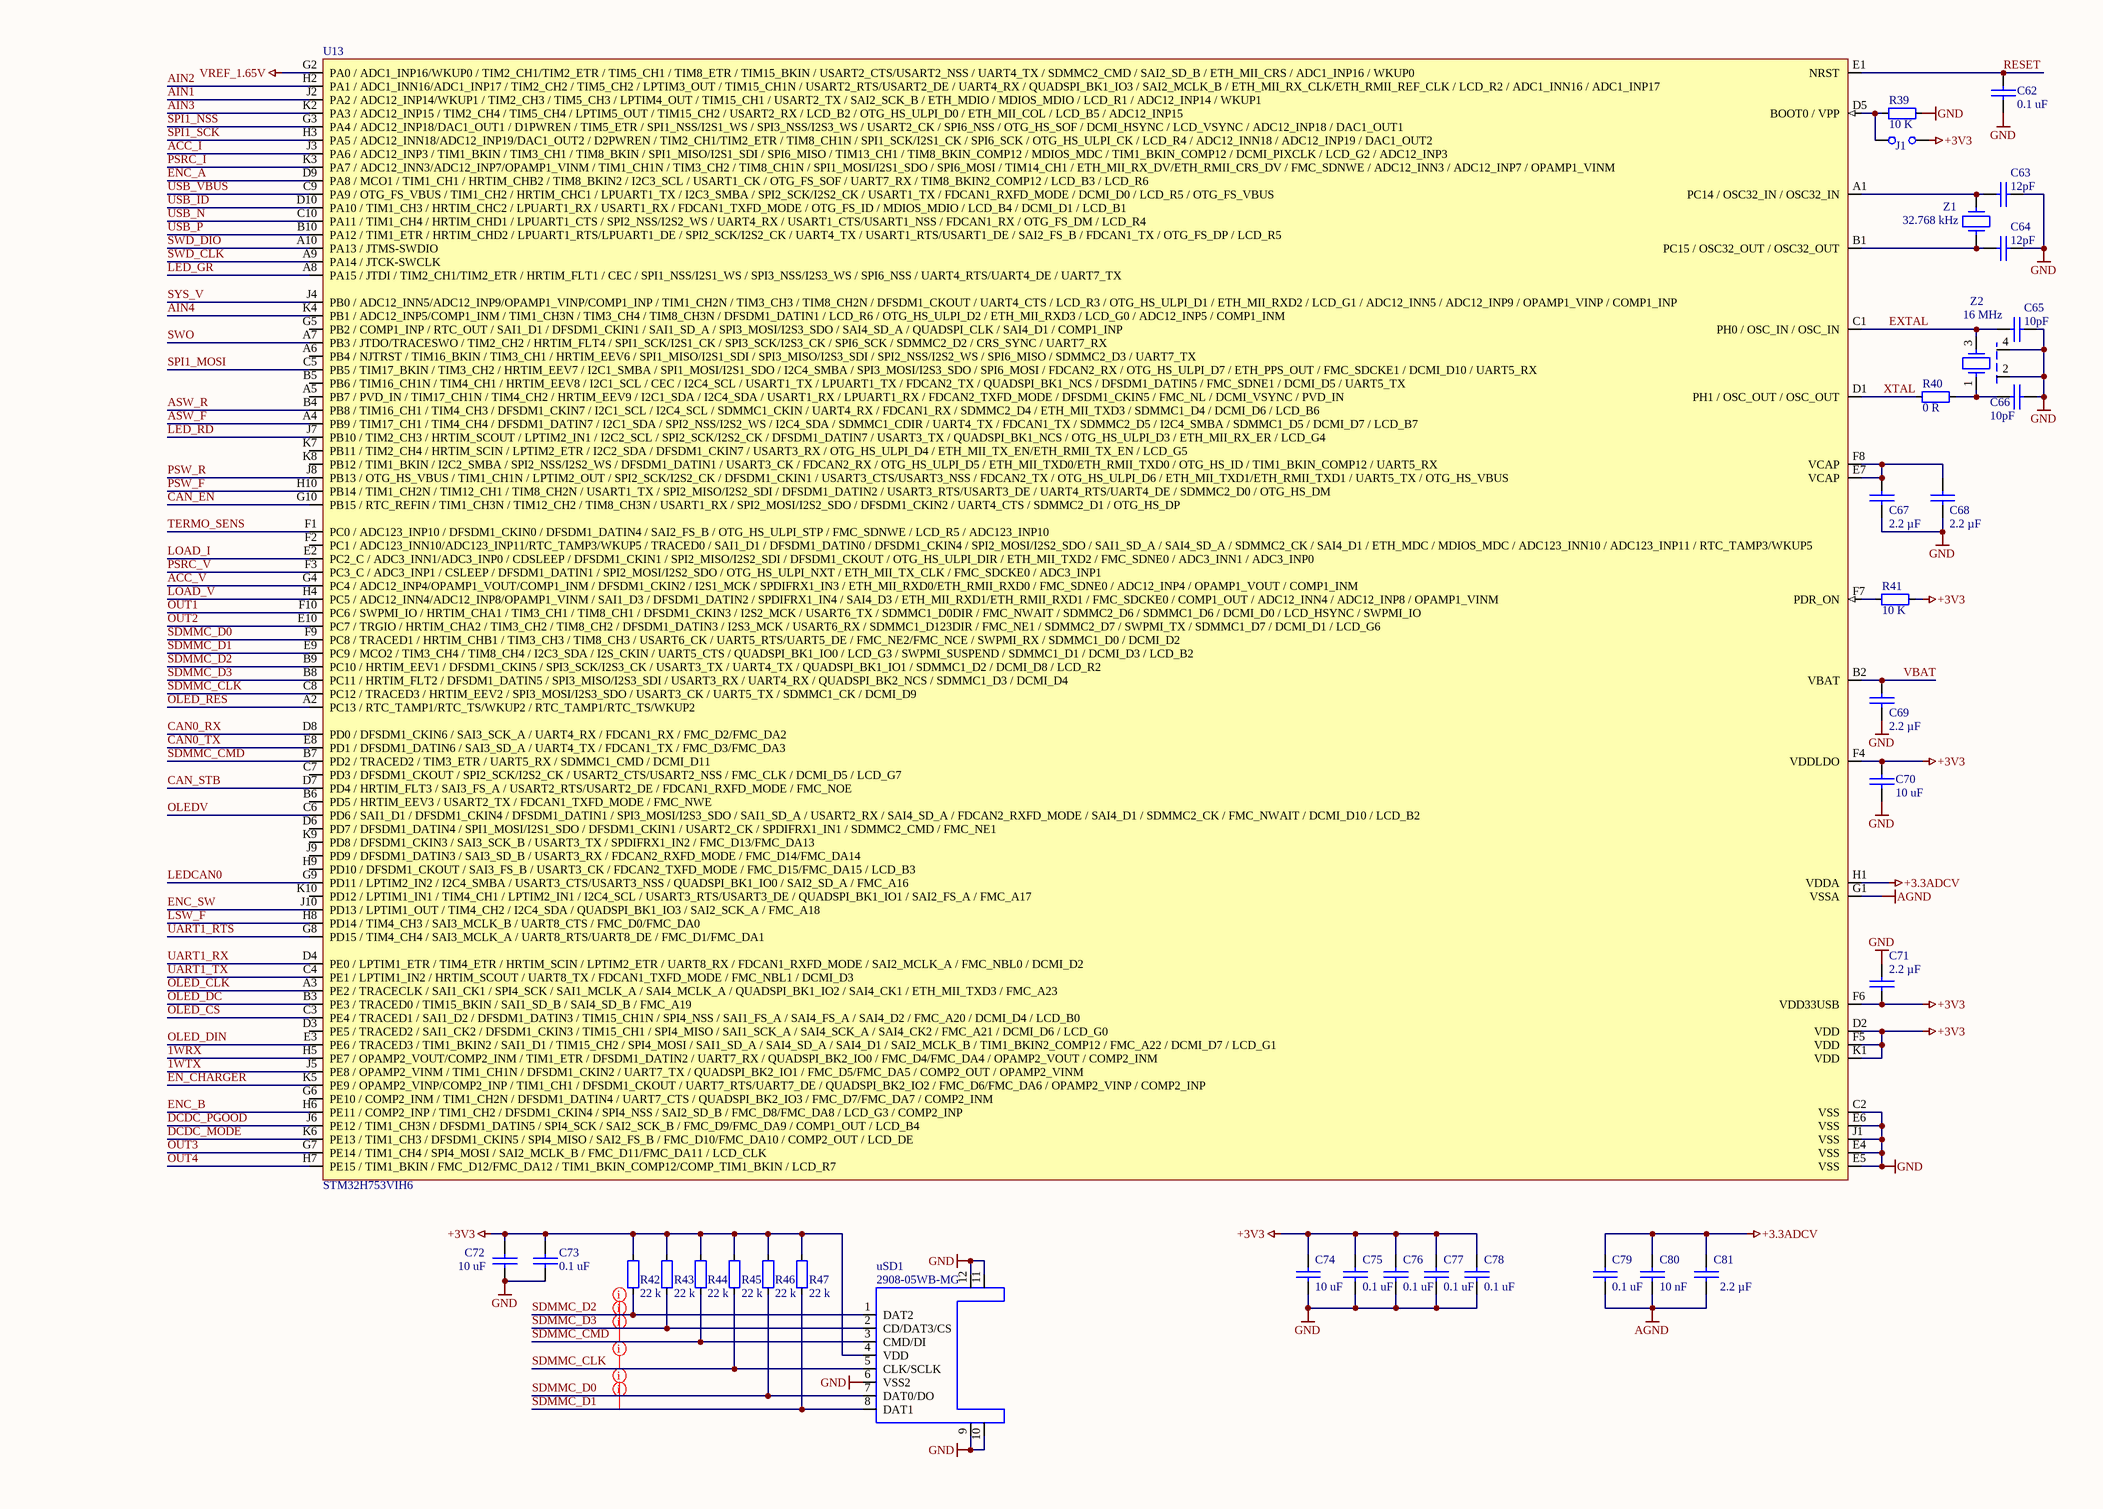
[diagram p1: BACKPMAN30_CPU.SchDoc]

### Parts
C62  value 0.1 uF  [1608[0603]]  (hidden comment: CL10B104KA8NNND)
C63  value 12pF  [0402 CAP]  (hidden comment: Capacitor)
C64  value 12pF  [0402 CAP]  (hidden comment: Capacitor)
C65  value 10pF  [0402 CAP]  (hidden comment: Capacitor)
C66  value 10pF  [0402 CAP]  (hidden comment: Capacitor)
C67  value 2.2 µF  [1608[0603]]  (hidden comment: C1608X5R1C225K080AB)
C68  value 2.2 µF  [1608[0603]]  (hidden comment: C1608X5R1C225K080AB)
C69  value 2.2 µF  [1608[0603]]  (hidden comment: C1608X5R1C225K080AB)
C70  value 10 uF  [2012[0805]]  (hidden comment: GRM21BR61E106KA73L)
C71  value 2.2 µF  [1608[0603]]  (hidden comment: C1608X5R1C225K080AB)
C72  value 10 uF  [2012[0805]]  (hidden comment: GRM21BR61E106KA73L)
C73  value 0.1 uF  [1608[0603]]  (hidden comment: 0603B104K500CT)
C74  value 10 uF  [2012[0805]]  (hidden comment: GRM21BR61E106KA73L)
C75  value 0.1 uF  [1608[0603]]  (hidden comment: CL10B104KA8NNND)
C76  value 0.1 uF  [1608[0603]]  (hidden comment: CL10B104KA8NNND)
C77  value 0.1 uF  [1608[0603]]  (hidden comment: CL10B104KA8NNND)
C78  value 0.1 uF  [1608[0603]]  (hidden comment: CL10B104KA8NNND)
C79  value 0.1 uF  [1608[0603]]  (hidden comment: CL10B104KA8NNND)
C80  value 10 nF  [1608[0603]]  (hidden comment: GMC10X7R103M50NT)
C81  value 2.2 µF  [1608[0603]]  (hidden comment: C1608X5R1C225K080AB)
J1  PH1-02-TA-HT  [HDR1X2V]  (value not drawn)
R39  value 10 K  [0603]  (hidden comment: RMCF0603FT10K0)
R40  value 0 R  [0603]  (hidden comment: CR0603-10W-000T)
R41  value 10 K  [0603]  (hidden comment: RMCF0603FT10K0)
R42  value 22 k  [0402]  (hidden comment: Resistor)
R43  value 22 k  [0402]  (hidden comment: Resistor)
R44  value 22 k  [0402]  (hidden comment: Resistor)
R45  value 22 k  [0402]  (hidden comment: Resistor)
R46  value 22 k  [0402]  (hidden comment: Resistor)
R47  value 22 k  [0402]  (hidden comment: Resistor)
U13  STM32H753VIH6  [TFBGA100]
uSD1  2908-05WB-MG  [2908-05WB-MG]
Z1  value 32.768 kHz  [ABS7]  (hidden comment: ABS07-32.768KHZ-T)
Z2  value 16 MHz  [4-SMD 2.00mm x 1.60mm]  (hidden comment: ABM11-16.000MHZ-9-B1U-T)

### Nets
+3.3ADCV: C79.2 C80.1 C81.1 U13.H1(VDDA)
+3V3: C70.2 C71.2 C72.2 C73.2 C74.2 C75.2 C76.2 C77.2 C78.2 J1.2 R41.1 R42.2 R43.2 R44.2 R45.2 R46.2 R47.2 U13.D2(VDD) U13.F4(VDDLDO) U13.F5(VDD) U13.F6(VDD33USB) U13.K1(VDD) uSD1.4(VDD)
AGND: C79.1 C80.2 C81.2 U13.G1(VSSA)
GND: C62.2 C63.2 C64.2 C65.2 C66.2 C67.2 C68.2 C69.2 C70.1 C71.1 C72.1 C73.1 C74.1 C75.1 C76.1 C77.1 C78.1 R39.1 U13.C2(VSS) U13.E4(VSS) U13.E5(VSS) U13.E6(VSS) U13.J1(VSS) uSD1.6(VSS2) uSD1.9 uSD1.10(WP) uSD1.11(GND) uSD1.12(GND) Z2.2 Z2.4
VREF_1.65V: U13.G2(PA0_/_ADC1_INP16/WKUP0_/_TIM2_CH1/TIM2_ETR_/_TIM5_CH1_/_TIM8_ETR_/_TIM15_BKIN_/_USART2_CTS/USART2_NSS_/_UART4_TX_/_SDMMC2_CMD_/_SAI2_SD_B_/_ETH_MII_CRS_/_ADC1_INP16_/_WKUP0)
1WRX: U13.H5(PE7_/_OPAMP2_VOUT/COMP2_INM_/_TIM1_ETR_/_DFSDM1_DATIN2_/_UART7_RX_/_QUADSPI_BK2_IO0_/_FMC_D4/FMC_DA4_/_OPAMP2_VOUT_/_COMP2_INM)
1WTX: U13.J5(PE8_/_OPAMP2_VINM_/_TIM1_CH1N_/_DFSDM1_CKIN2_/_UART7_TX_/_QUADSPI_BK2_IO1_/_FMC_D5/FMC_DA5_/_COMP2_OUT_/_OPAMP2_VINM)
ACC_I: U13.J3(PA6_/_ADC12_INP3_/_TIM1_BKIN_/_TIM3_CH1_/_TIM8_BKIN_/_SPI1_MISO/I2S1_SDI_/_SPI6_MISO_/_TIM13_CH1_/_TIM8_BKIN_COMP12_/_MDIOS_MDC_/_TIM1_BKIN_COMP12_/_DCMI_PIXCLK_/_LCD_G2_/_ADC12_INP3)
ACC_V: U13.G4(PC4_/_ADC12_INP4/OPAMP1_VOUT/COMP1_INM_/_DFSDM1_CKIN2_/_I2S1_MCK_/_SPDIFRX1_IN3_/_ETH_MII_RXD0/ETH_RMII_RXD0_/_FMC_SDNE0_/_ADC12_INP4_/_OPAMP1_VOUT_/_COMP1_INM)
AIN1: U13.J2(PA2_/_ADC12_INP14/WKUP1_/_TIM2_CH3_/_TIM5_CH3_/_LPTIM4_OUT_/_TIM15_CH1_/_USART2_TX_/_SAI2_SCK_B_/_ETH_MDIO_/_MDIOS_MDIO_/_LCD_R1_/_ADC12_INP14_/_WKUP1)
AIN2: U13.H2(PA1_/_ADC1_INN16/ADC1_INP17_/_TIM2_CH2_/_TIM5_CH2_/_LPTIM3_OUT_/_TIM15_CH1N_/_USART2_RTS/USART2_DE_/_UART4_RX_/_QUADSPI_BK1_IO3_/_SAI2_MCLK_B_/_ETH_MII_RX_CLK/ETH_RMII_REF_CLK_/_LCD_R2_/_ADC1_INN16_/_ADC1_INP17)
AIN3: U13.K2(PA3_/_ADC12_INP15_/_TIM2_CH4_/_TIM5_CH4_/_LPTIM5_OUT_/_TIM15_CH2_/_USART2_RX_/_LCD_B2_/_OTG_HS_ULPI_D0_/_ETH_MII_COL_/_LCD_B5_/_ADC12_INP15)
AIN4: U13.K4(PB1_/_ADC12_INP5/COMP1_INM_/_TIM1_CH3N_/_TIM3_CH4_/_TIM8_CH3N_/_DFSDM1_DATIN1_/_LCD_R6_/_OTG_HS_ULPI_D2_/_ETH_MII_RXD3_/_LCD_G0_/_ADC12_INP5_/_COMP1_INM)
ASW_F: U13.A4(PB9_/_TIM17_CH1_/_TIM4_CH4_/_DFSDM1_DATIN7_/_I2C1_SDA_/_SPI2_NSS/I2S2_WS_/_I2C4_SDA_/_SDMMC1_CDIR_/_UART4_TX_/_FDCAN1_TX_/_SDMMC2_D5_/_I2C4_SMBA_/_SDMMC1_D5_/_DCMI_D7_/_LCD_B7)
ASW_R: U13.B4(PB8_/_TIM16_CH1_/_TIM4_CH3_/_DFSDM1_CKIN7_/_I2C1_SCL_/_I2C4_SCL_/_SDMMC1_CKIN_/_UART4_RX_/_FDCAN1_RX_/_SDMMC2_D4_/_ETH_MII_TXD3_/_SDMMC1_D4_/_DCMI_D6_/_LCD_B6)
CAN0_RX: U13.D8(PD0_/_DFSDM1_CKIN6_/_SAI3_SCK_A_/_UART4_RX_/_FDCAN1_RX_/_FMC_D2/FMC_DA2)
CAN0_TX: U13.E8(PD1_/_DFSDM1_DATIN6_/_SAI3_SD_A_/_UART4_TX_/_FDCAN1_TX_/_FMC_D3/FMC_DA3)
CAN_EN: U13.G10(PB15_/_RTC_REFIN_/_TIM1_CH3N_/_TIM12_CH2_/_TIM8_CH3N_/_USART1_RX_/_SPI2_MOSI/I2S2_SDO_/_DFSDM1_CKIN2_/_UART4_CTS_/_SDMMC2_D1_/_OTG_HS_DP)
CAN_STB: U13.D7(PD4_/_HRTIM_FLT3_/_SAI3_FS_A_/_USART2_RTS/USART2_DE_/_FDCAN1_RXFD_MODE_/_FMC_NOE)
DCDC_MODE: U13.K6(PE13_/_TIM1_CH3_/_DFSDM1_CKIN5_/_SPI4_MISO_/_SAI2_FS_B_/_FMC_D10/FMC_DA10_/_COMP2_OUT_/_LCD_DE)
DCDC_PGOOD: U13.J6(PE12_/_TIM1_CH3N_/_DFSDM1_DATIN5_/_SPI4_SCK_/_SAI2_SCK_B_/_FMC_D9/FMC_DA9_/_COMP1_OUT_/_LCD_B4)
EN_CHARGER: U13.K5(PE9_/_OPAMP2_VINP/COMP2_INP_/_TIM1_CH1_/_DFSDM1_CKOUT_/_UART7_RTS/UART7_DE_/_QUADSPI_BK2_IO2_/_FMC_D6/FMC_DA6_/_OPAMP2_VINP_/_COMP2_INP)
ENC_A: U13.D9(PA8_/_MCO1_/_TIM1_CH1_/_HRTIM_CHB2_/_TIM8_BKIN2_/_I2C3_SCL_/_USART1_CK_/_OTG_FS_SOF_/_UART7_RX_/_TIM8_BKIN2_COMP12_/_LCD_B3_/_LCD_R6)
ENC_B: U13.H6(PE11_/_COMP2_INP_/_TIM1_CH2_/_DFSDM1_CKIN4_/_SPI4_NSS_/_SAI2_SD_B_/_FMC_D8/FMC_DA8_/_LCD_G3_/_COMP2_INP)
ENC_SW: U13.J10(PD13_/_LPTIM1_OUT_/_TIM4_CH2_/_I2C4_SDA_/_QUADSPI_BK1_IO3_/_SAI2_SCK_A_/_FMC_A18)
EXTAL: C65.1 U13.C1(PH0_/_OSC_IN_/_OSC_IN) Z2.3
LED_GR: U13.A8(PA15_/_JTDI_/_TIM2_CH1/TIM2_ETR_/_HRTIM_FLT1_/_CEC_/_SPI1_NSS/I2S1_WS_/_SPI3_NSS/I2S3_WS_/_SPI6_NSS_/_UART4_RTS/UART4_DE_/_UART7_TX)
LED_RD: U13.J7(PB10_/_TIM2_CH3_/_HRTIM_SCOUT_/_LPTIM2_IN1_/_I2C2_SCL_/_SPI2_SCK/I2S2_CK_/_DFSDM1_DATIN7_/_USART3_TX_/_QUADSPI_BK1_NCS_/_OTG_HS_ULPI_D3_/_ETH_MII_RX_ER_/_LCD_G4)
LEDCAN0: U13.G9(PD11_/_LPTIM2_IN2_/_I2C4_SMBA_/_USART3_CTS/USART3_NSS_/_QUADSPI_BK1_IO0_/_SAI2_SD_A_/_FMC_A16)
LOAD_I: U13.E2(PC2_C_/_ADC3_INN1/ADC3_INP0_/_CDSLEEP_/_DFSDM1_CKIN1_/_SPI2_MISO/I2S2_SDI_/_DFSDM1_CKOUT_/_OTG_HS_ULPI_DIR_/_ETH_MII_TXD2_/_FMC_SDNE0_/_ADC3_INN1_/_ADC3_INP0)
LOAD_V: U13.H4(PC5_/_ADC12_INN4/ADC12_INP8/OPAMP1_VINM_/_SAI1_D3_/_DFSDM1_DATIN2_/_SPDIFRX1_IN4_/_SAI4_D3_/_ETH_MII_RXD1/ETH_RMII_RXD1_/_FMC_SDCKE0_/_COMP1_OUT_/_ADC12_INN4_/_ADC12_INP8_/_OPAMP1_VINM)
LSW_F: U13.H8(PD14_/_TIM4_CH3_/_SAI3_MCLK_B_/_UART8_CTS_/_FMC_D0/FMC_DA0)
OLED_CLK: U13.A3(PE2_/_TRACECLK_/_SAI1_CK1_/_SPI4_SCK_/_SAI1_MCLK_A_/_SAI4_MCLK_A_/_QUADSPI_BK1_IO2_/_SAI4_CK1_/_ETH_MII_TXD3_/_FMC_A23)
OLED_CS: U13.C3(PE4_/_TRACED1_/_SAI1_D2_/_DFSDM1_DATIN3_/_TIM15_CH1N_/_SPI4_NSS_/_SAI1_FS_A_/_SAI4_FS_A_/_SAI4_D2_/_FMC_A20_/_DCMI_D4_/_LCD_B0)
OLED_DC: U13.B3(PE3_/_TRACED0_/_TIM15_BKIN_/_SAI1_SD_B_/_SAI4_SD_B_/_FMC_A19)
OLED_DIN: U13.E3(PE6_/_TRACED3_/_TIM1_BKIN2_/_SAI1_D1_/_TIM15_CH2_/_SPI4_MOSI_/_SAI1_SD_A_/_SAI4_SD_A_/_SAI4_D1_/_SAI2_MCLK_B_/_TIM1_BKIN2_COMP12_/_FMC_A22_/_DCMI_D7_/_LCD_G1)
OLED_RES: U13.A2(PC13_/_RTC_TAMP1/RTC_TS/WKUP2_/_RTC_TAMP1/RTC_TS/WKUP2)
OLEDV: U13.C6(PD6_/_SAI1_D1_/_DFSDM1_CKIN4_/_DFSDM1_DATIN1_/_SPI3_MOSI/I2S3_SDO_/_SAI1_SD_A_/_USART2_RX_/_SAI4_SD_A_/_FDCAN2_RXFD_MODE_/_SAI4_D1_/_SDMMC2_CK_/_FMC_NWAIT_/_DCMI_D10_/_LCD_B2)
OUT1: U13.F10(PC6_/_SWPMI_IO_/_HRTIM_CHA1_/_TIM3_CH1_/_TIM8_CH1_/_DFSDM1_CKIN3_/_I2S2_MCK_/_USART6_TX_/_SDMMC1_D0DIR_/_FMC_NWAIT_/_SDMMC2_D6_/_SDMMC1_D6_/_DCMI_D0_/_LCD_HSYNC_/_SWPMI_IO)
OUT2: U13.E10(PC7_/_TRGIO_/_HRTIM_CHA2_/_TIM3_CH2_/_TIM8_CH2_/_DFSDM1_DATIN3_/_I2S3_MCK_/_USART6_RX_/_SDMMC1_D123DIR_/_FMC_NE1_/_SDMMC2_D7_/_SWPMI_TX_/_SDMMC1_D7_/_DCMI_D1_/_LCD_G6)
OUT3: U13.G7(PE14_/_TIM1_CH4_/_SPI4_MOSI_/_SAI2_MCLK_B_/_FMC_D11/FMC_DA11_/_LCD_CLK)
OUT4: U13.H7(PE15_/_TIM1_BKIN_/_FMC_D12/FMC_DA12_/_TIM1_BKIN_COMP12/COMP_TIM1_BKIN_/_LCD_R7)
PSRC_I: U13.K3(PA7_/_ADC12_INN3/ADC12_INP7/OPAMP1_VINM_/_TIM1_CH1N_/_TIM3_CH2_/_TIM8_CH1N_/_SPI1_MOSI/I2S1_SDO_/_SPI6_MOSI_/_TIM14_CH1_/_ETH_MII_RX_DV/ETH_RMII_CRS_DV_/_FMC_SDNWE_/_ADC12_INN3_/_ADC12_INP7_/_OPAMP1_VINM)
PSRC_V: U13.F3(PC3_C_/_ADC3_INP1_/_CSLEEP_/_DFSDM1_DATIN1_/_SPI2_MOSI/I2S2_SDO_/_OTG_HS_ULPI_NXT_/_ETH_MII_TX_CLK_/_FMC_SDCKE0_/_ADC3_INP1)
PSW_F: U13.H10(PB14_/_TIM1_CH2N_/_TIM12_CH1_/_TIM8_CH2N_/_USART1_TX_/_SPI2_MISO/I2S2_SDI_/_DFSDM1_DATIN2_/_USART3_RTS/USART3_DE_/_UART4_RTS/UART4_DE_/_SDMMC2_D0_/_OTG_HS_DM)
PSW_R: U13.J8(PB13_/_OTG_HS_VBUS_/_TIM1_CH1N_/_LPTIM2_OUT_/_SPI2_SCK/I2S2_CK_/_DFSDM1_CKIN1_/_USART3_CTS/USART3_NSS_/_FDCAN2_TX_/_OTG_HS_ULPI_D6_/_ETH_MII_TXD1/ETH_RMII_TXD1_/_UART5_TX_/_OTG_HS_VBUS)
RESET: C62.1 U13.E1(NRST)
SDMMC_CLK: R45.1 U13.C8(PC12_/_TRACED3_/_HRTIM_EEV2_/_SPI3_MOSI/I2S3_SDO_/_USART3_CK_/_UART5_TX_/_SDMMC1_CK_/_DCMI_D9) uSD1.5(CLK/SCLK)
SDMMC_CMD: R44.1 U13.B7(PD2_/_TRACED2_/_TIM3_ETR_/_UART5_RX_/_SDMMC1_CMD_/_DCMI_D11) uSD1.3(CMD/DI)
SDMMC_D0: R46.1 U13.F9(PC8_/_TRACED1_/_HRTIM_CHB1_/_TIM3_CH3_/_TIM8_CH3_/_USART6_CK_/_UART5_RTS/UART5_DE_/_FMC_NE2/FMC_NCE_/_SWPMI_RX_/_SDMMC1_D0_/_DCMI_D2) uSD1.7(DAT0/DO)
SDMMC_D1: R47.1 U13.E9(PC9_/_MCO2_/_TIM3_CH4_/_TIM8_CH4_/_I2C3_SDA_/_I2S_CKIN_/_UART5_CTS_/_QUADSPI_BK1_IO0_/_LCD_G3_/_SWPMI_SUSPEND_/_SDMMC1_D1_/_DCMI_D3_/_LCD_B2) uSD1.8(DAT1)
SDMMC_D2: R42.1 U13.B9(PC10_/_HRTIM_EEV1_/_DFSDM1_CKIN5_/_SPI3_SCK/I2S3_CK_/_USART3_TX_/_UART4_TX_/_QUADSPI_BK1_IO1_/_SDMMC1_D2_/_DCMI_D8_/_LCD_R2) uSD1.1(DAT2)
SDMMC_D3: R43.1 U13.B8(PC11_/_HRTIM_FLT2_/_DFSDM1_DATIN5_/_SPI3_MISO/I2S3_SDI_/_USART3_RX_/_UART4_RX_/_QUADSPI_BK2_NCS_/_SDMMC1_D3_/_DCMI_D4) uSD1.2(CD/DAT3/CS)
SPI1_MOSI: U13.C5(PB5_/_TIM17_BKIN_/_TIM3_CH2_/_HRTIM_EEV7_/_I2C1_SMBA_/_SPI1_MOSI/I2S1_SDO_/_I2C4_SMBA_/_SPI3_MOSI/I2S3_SDO_/_SPI6_MOSI_/_FDCAN2_RX_/_OTG_HS_ULPI_D7_/_ETH_PPS_OUT_/_FMC_SDCKE1_/_DCMI_D10_/_UART5_RX)
SPI1_NSS: U13.G3(PA4_/_ADC12_INP18/DAC1_OUT1_/_D1PWREN_/_TIM5_ETR_/_SPI1_NSS/I2S1_WS_/_SPI3_NSS/I2S3_WS_/_USART2_CK_/_SPI6_NSS_/_OTG_HS_SOF_/_DCMI_HSYNC_/_LCD_VSYNC_/_ADC12_INP18_/_DAC1_OUT1)
SPI1_SCK: U13.H3(PA5_/_ADC12_INN18/ADC12_INP19/DAC1_OUT2_/_D2PWREN_/_TIM2_CH1/TIM2_ETR_/_TIM8_CH1N_/_SPI1_SCK/I2S1_CK_/_SPI6_SCK_/_OTG_HS_ULPI_CK_/_LCD_R4_/_ADC12_INN18_/_ADC12_INP19_/_DAC1_OUT2)
SWD_CLK: U13.A9(PA14_/_JTCK-SWCLK)
SWD_DIO: U13.A10(PA13_/_JTMS-SWDIO)
SWO: U13.A7(PB3_/_JTDO/TRACESWO_/_TIM2_CH2_/_HRTIM_FLT4_/_SPI1_SCK/I2S1_CK_/_SPI3_SCK/I2S3_CK_/_SPI6_SCK_/_SDMMC2_D2_/_CRS_SYNC_/_UART7_RX)
SYS_V: U13.J4(PB0_/_ADC12_INN5/ADC12_INP9/OPAMP1_VINP/COMP1_INP_/_TIM1_CH2N_/_TIM3_CH3_/_TIM8_CH2N_/_DFSDM1_CKOUT_/_UART4_CTS_/_LCD_R3_/_OTG_HS_ULPI_D1_/_ETH_MII_RXD2_/_LCD_G1_/_ADC12_INN5_/_ADC12_INP9_/_OPAMP1_VINP_/_COMP1_INP)
TERMO_SENS: U13.F1(PC0_/_ADC123_INP10_/_DFSDM1_CKIN0_/_DFSDM1_DATIN4_/_SAI2_FS_B_/_OTG_HS_ULPI_STP_/_FMC_SDNWE_/_LCD_R5_/_ADC123_INP10)
UART1_RTS: U13.G8(PD15_/_TIM4_CH4_/_SAI3_MCLK_A_/_UART8_RTS/UART8_DE_/_FMC_D1/FMC_DA1)
UART1_RX: U13.D4(PE0_/_LPTIM1_ETR_/_TIM4_ETR_/_HRTIM_SCIN_/_LPTIM2_ETR_/_UART8_RX_/_FDCAN1_RXFD_MODE_/_SAI2_MCLK_A_/_FMC_NBL0_/_DCMI_D2)
UART1_TX: U13.C4(PE1_/_LPTIM1_IN2_/_HRTIM_SCOUT_/_UART8_TX_/_FDCAN1_TXFD_MODE_/_FMC_NBL1_/_DCMI_D3)
USB_ID: U13.D10(PA10_/_TIM1_CH3_/_HRTIM_CHC2_/_LPUART1_RX_/_USART1_RX_/_FDCAN1_TXFD_MODE_/_OTG_FS_ID_/_MDIOS_MDIO_/_LCD_B4_/_DCMI_D1_/_LCD_B1)
USB_N: U13.C10(PA11_/_TIM1_CH4_/_HRTIM_CHD1_/_LPUART1_CTS_/_SPI2_NSS/I2S2_WS_/_UART4_RX_/_USART1_CTS/USART1_NSS_/_FDCAN1_RX_/_OTG_FS_DM_/_LCD_R4)
USB_P: U13.B10(PA12_/_TIM1_ETR_/_HRTIM_CHD2_/_LPUART1_RTS/LPUART1_DE_/_SPI2_SCK/I2S2_CK_/_UART4_TX_/_USART1_RTS/USART1_DE_/_SAI2_FS_B_/_FDCAN1_TX_/_OTG_FS_DP_/_LCD_R5)
USB_VBUS: U13.C9(PA9_/_OTG_FS_VBUS_/_TIM1_CH2_/_HRTIM_CHC1_/_LPUART1_TX_/_I2C3_SMBA_/_SPI2_SCK/I2S2_CK_/_USART1_TX_/_FDCAN1_RXFD_MODE_/_DCMI_D0_/_LCD_R5_/_OTG_FS_VBUS)
VBAT: C69.1 U13.B2(VBAT)
XTAL: R40.2 U13.D1(PH1_/_OSC_OUT_/_OSC_OUT)
NetC63_1: C63.1 U13.A1(PC14_/_OSC32_IN_/_OSC32_IN) Z1.2
NetC64_1: C64.1 U13.B1(PC15_/_OSC32_OUT_/_OSC32_OUT) Z1.1
NetC66_1: C66.1 R40.1 Z2.1
NetC67_1: C67.1 C68.1 U13.E7(VCAP) U13.F8(VCAP)
NetJ1_1: J1.1 R39.2 U13.D5(BOOT0_/_VPP)
NetR41_2: R41.2 U13.F7(PDR_ON)

Not connected (* = marked no-connect by the designer): U13 A5(PB7_/_PVD_IN_/_TIM17_CH1N_/_TIM4_CH2_/_HRTIM_EEV9_/_I2C1_SDA_/_I2C4_SDA_/_USART1_RX_/_LPUART1_RX_/_FDCAN2_TXFD_MODE_/_DFSDM1_CKIN5_/_FMC_NL_/_DCMI_VSYNC_/_PVD_IN) A6(PB4_/_NJTRST_/_TIM16_BKIN_/_TIM3_CH1_/_HRTIM_EEV6_/_SPI1_MISO/I2S1_SDI_/_SPI3_MISO/I2S3_SDI_/_SPI2_NSS/I2S2_WS_/_SPI6_MISO_/_SDMMC2_D3_/_UART7_TX) B5(PB6_/_TIM16_CH1N_/_TIM4_CH1_/_HRTIM_EEV8_/_I2C1_SCL_/_CEC_/_I2C4_SCL_/_USART1_TX_/_LPUART1_TX_/_FDCAN2_TX_/_QUADSPI_BK1_NCS_/_DFSDM1_DATIN5_/_FMC_SDNE1_/_DCMI_D5_/_UART5_TX) B6(PD5_/_HRTIM_EEV3_/_USART2_TX_/_FDCAN1_TXFD_MODE_/_FMC_NWE) C7(PD3_/_DFSDM1_CKOUT_/_SPI2_SCK/I2S2_CK_/_USART2_CTS/USART2_NSS_/_FMC_CLK_/_DCMI_D5_/_LCD_G7) D3(PE5_/_TRACED2_/_SAI1_CK2_/_DFSDM1_CKIN3_/_TIM15_CH1_/_SPI4_MISO_/_SAI1_SCK_A_/_SAI4_SCK_A_/_SAI4_CK2_/_FMC_A21_/_DCMI_D6_/_LCD_G0) D6(PD7_/_DFSDM1_DATIN4_/_SPI1_MOSI/I2S1_SDO_/_DFSDM1_CKIN1_/_USART2_CK_/_SPDIFRX1_IN1_/_SDMMC2_CMD_/_FMC_NE1) F2(PC1_/_ADC123_INN10/ADC123_INP11/RTC_TAMP3/WKUP5_/_TRACED0_/_SAI1_D1_/_DFSDM1_DATIN0_/_DFSDM1_CKIN4_/_SPI2_MOSI/I2S2_SDO_/_SAI1_SD_A_/_SAI4_SD_A_/_SDMMC2_CK_/_SAI4_D1_/_ETH_MDC_/_MDIOS_MDC_/_ADC123_INN10_/_ADC123_INP11_/_RTC_TAMP3/WKUP5) G5(PB2_/_COMP1_INP_/_RTC_OUT_/_SAI1_D1_/_DFSDM1_CKIN1_/_SAI1_SD_A_/_SPI3_MOSI/I2S3_SDO_/_SAI4_SD_A_/_QUADSPI_CLK_/_SAI4_D1_/_COMP1_INP) G6(PE10_/_COMP2_INM_/_TIM1_CH2N_/_DFSDM1_DATIN4_/_UART7_CTS_/_QUADSPI_BK2_IO3_/_FMC_D7/FMC_DA7_/_COMP2_INM) H9(PD10_/_DFSDM1_CKOUT_/_SAI3_FS_B_/_USART3_CK_/_FDCAN2_TXFD_MODE_/_FMC_D15/FMC_DA15_/_LCD_B3) J9(PD9_/_DFSDM1_DATIN3_/_SAI3_SD_B_/_USART3_RX_/_FDCAN2_RXFD_MODE_/_FMC_D14/FMC_DA14) K7(PB11_/_TIM2_CH4_/_HRTIM_SCIN_/_LPTIM2_ETR_/_I2C2_SDA_/_DFSDM1_CKIN7_/_USART3_RX_/_OTG_HS_ULPI_D4_/_ETH_MII_TX_EN/ETH_RMII_TX_EN_/_LCD_G5) K8(PB12_/_TIM1_BKIN_/_I2C2_SMBA_/_SPI2_NSS/I2S2_WS_/_DFSDM1_DATIN1_/_USART3_CK_/_FDCAN2_RX_/_OTG_HS_ULPI_D5_/_ETH_MII_TXD0/ETH_RMII_TXD0_/_OTG_HS_ID_/_TIM1_BKIN_COMP12_/_UART5_RX) K9(PD8_/_DFSDM1_CKIN3_/_SAI3_SCK_B_/_USART3_TX_/_SPDIFRX1_IN2_/_FMC_D13/FMC_DA13) K10(PD12_/_LPTIM1_IN1_/_TIM4_CH1_/_LPTIM2_IN1_/_I2C4_SCL_/_USART3_RTS/USART3_DE_/_QUADSPI_BK1_IO1_/_SAI2_FS_A_/_FMC_A17)

### Layout directives
net class uSD: SDMMC_CLK, SDMMC_CMD, SDMMC_D0, SDMMC_D1, SDMMC_D2, SDMMC_D3

### Library data of the parts
C62 C73 C75-C79 = 0603B104K500CT: as C1 on sheet BACKPMAN30_Charger; Distributor: Digi-Key; PartName: 0603B104K500CT; Voltage: 50V; Price: 0.0062 Euro
C63 C64 = 0402N120G500CT: 12pF, ±2%, 50V, C0G, NP0, 0402 (1005 Metric), -55°C ~ 125°C, -, General Purpose; Manufacturer: Walsin Technology Corporation; PartNum: 1292-1250-1-ND; Voltage - Rated: 50V; Part Number: 0402N120G500CT; Distributor: Digi-Key; PartName: 0402N120G500CT; Price: 0.10000; Tolerance: ±2%; Temperature Coefficient: C0G, NP0; Operating Temperature: -55°C ~ 125°C; Features: -; Package / Case: 0402 (1005 Metric)
C65 C66 = GCM1555C1H100FA16D: 10pF, ±1%, 50V, C0G, NP0, 0402 (1005 Metric), -55°C ~ 125°C, -, Automotive; Manufacturer: Murata Electronics North America; PartNum: 490-14348-1-ND; Voltage - Rated: 50V; Part Number: GCM1555C1H100FA16D; Distributor: Digi-Key; PartName: GCM1555C1H100FA16D; Price: 0.15000; Tolerance: ±1%; Temperature Coefficient: C0G, NP0; Operating Temperature: -55°C ~ 125°C; Features: -; Package / Case: 0402 (1005 Metric)
C67-C69 C71 C81 = C1608X5R1C225K080AB: 2.2 µF ±10% 16V Ceramic Capacitor X5R 0603 (1608 Metric), -55°C ~ 85°C; Manufacturer: TDK Corporation; PartNum: 445-5157-1-ND; Distributor: Digi-Key; PartName: C1608X5R1C225K080AB; Price: 0.04$; Tolerance: ±10%; Voltage: 16 V
C70 C72 C74 = GRM21BR61E106KA73L: as C57 on sheet BACKPMAN30_Charger; Distributor: Digi-Key; Price: 0.11$; Tolerance: ±10%; Voltage: 25V; PartName: GRM21BR61E106KA73L
C80 = GMC10X7R103M50NT: as C52 on sheet BACKPMAN30_Charger; Distributor: Digi-Key; Voltage: 50 V; PartName: GMC10X7R103M50NT; Price: 0.0047 Euro
J1 = PH1-02-UA: Connector Header Through Hole 2 position 0.100" (2.54mm), Contact Length - Mating 6 mm; Manufacturer: Adam Tech; PartNum: 2057-PH1-02-UA-ND; Distributor: Digi-Key; PartName: PH1-02-UA
R39 R41 = RMCF0603FT10K0: as R25 on sheet BACKPMAN30_Charger; Distributor: Digi-Key; Price: 0.0017$; Tolerance: 1%; PartName: RMCF0603FT10K0
R40 = CR0603-10W-000T: 0 Ohms Jumper 0.1W, 1/10W Chip Resistor 0603 (1608 Metric) - Thick Film, -55°C ~ 155°C; Manufacturer: Venkel; PartNum: 2679-CR0603-10W-000TTR-ND; Voltage: 75 V; Distributor: Digi-Key; Price: 0.005$; PartName: CR0603-10W-000T
R42-R47 = RMCF0402FT22K0: 22 kOhms, ±1%, 0.063W, 1/16W, Thick Film, ±100ppm/°C, 0402 (1005 Metric), -55°C ~ 155°C, Automotive AEC-Q200; Manufacturer: Stackpole Electronics Inc; PartNum: RMCF0402FT22K0CT-ND; Voltage: 75V; Distributor: Digi-Key; Price: 0.10000; Tolerance: ±1%; PartName: RMCF0402FT22K0; Part Number: RMCF0402FT22K0; Temperature Coefficient: ±100ppm/°C; Operating Temperature: -55°C ~ 155°C; Power (Watts): 0.063W, 1/16W; Features: Automotive AEC-Q200; Package / Case: 0402 (1005 Metric)
U13 = STM32H753VIH6: Cortex-M7, 480MHz 2MB FLASH, 1MB RAM, 100-TFBGA (8x8); Manufacturer: STMicroelectronics; PartNum: STM32H753VIH6-ND; Distributor: Digi-Key; PartName: STM32H753VIH6; Price: 9.89$
uSD1 = 2908-05WB-MG: microSD cadr holder; Manufacturer: 3M; Price: 2.71$; Distributor: Farnell; PartNum: 2908-05WB-MG; PartName: 2908-05WB-MG
Z1 = ABS07-32.768KHZ-T: 32.768 kHz, 12.5 pF, 70 kOhm, ±20ppm, 3.2 x 1.5 mm, -40°C ~ 85°C; Manufacturer: Abracon Corporation; PartNum: 535-9542-1-ND; Price: 1.09$; Distributor: Digi-Key; Tolerance: 20 ppm; PartName: ABS07-32.768KHZ-T
Z2 = ABM11-16.000MHZ-9-B1U-T: 16 MHz, 9 pF, ±10ppm, 2.00mm x 1.60mm, -20°C ~ 70°C; Manufacturer: Abracon LLC; PartNum: 535-13598-1-ND; Price: 0.98 $; Distributor: Digi-Key; Tolerance: 10 ppm; PartName: ABM11-16.000MHZ-9-B1U-T; Supplier 1: Digi-Key; Supplier Part Number 1: 535-13598-2-ND